# EAGLE design clock_generator (EAGLE 9.6.2)
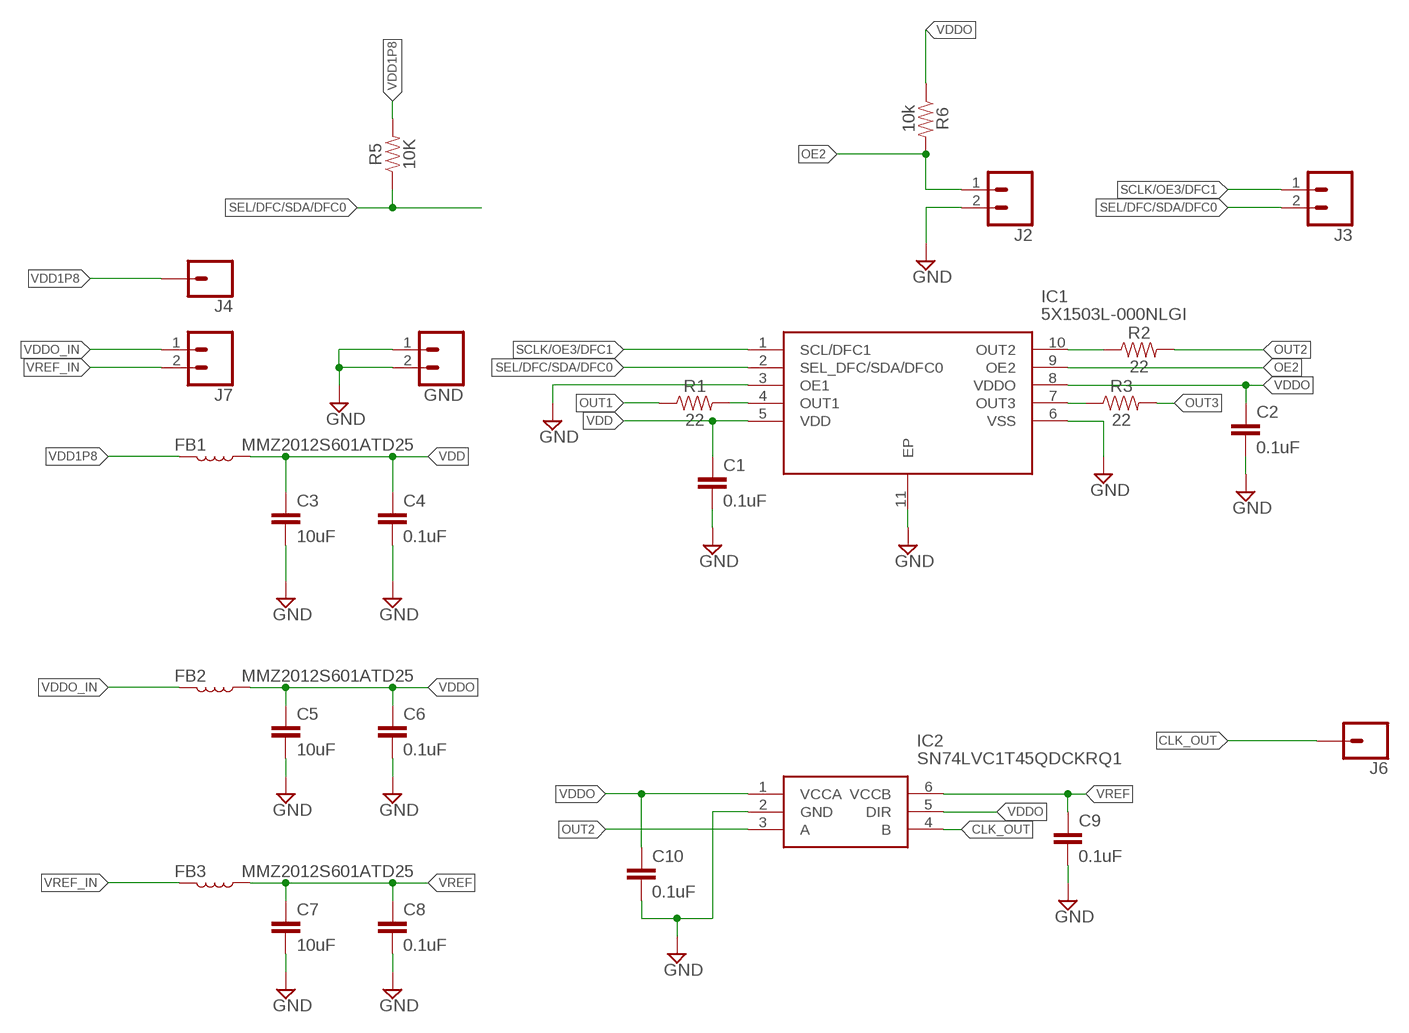
[diagram p0: schematic, sheet 1]

## Parts
C1  0.1uF  1.0UF-0805-25V-10%  [0805]
C2  0.1uF  1.0UF-0805-25V-10%  [0805]
C3  10uF  1.0UF-0805-25V-10%  [0805]
C4  0.1uF  1.0UF-0805-25V-10%  [0805]
C5  10uF  1.0UF-0805-25V-10%  [0805]
C6  0.1uF  1.0UF-0805-25V-10%  [0805]
C7  10uF  1.0UF-0805-25V-10%  [0805]
C8  0.1uF  1.0UF-0805-25V-10%  [0805]
C9  0.1uF  1.0UF-0805-25V-10%  [0805]
C10  0.1uF  1.0UF-0805-25V-10%  [0805]
FB1  MMZ2012S601ATD25  INDUCTOR-0805-3.3UH  [0805]
FB2  MMZ2012S601ATD25  INDUCTOR-0805-3.3UH  [0805]
FB3  MMZ2012S601ATD25  INDUCTOR-0805-3.3UH  [0805]
GND  CONN_02  [1X02]
IC1  5X1503L-000NLGI  [SON40P200X200X110-11N]
IC2  SN74LVC1T45QDCKRQ1  [SOT65P210X110-6N]
J2  CONN_02  [1X02]
J3  CONN_02  [1X02]
J4  CONN_01  [1X01]
J6  CONN_01  [1X01]
J7  CONN_02  [1X02]
R1  22  0.75OHM-0805-1/4W-1%  [0805]
R2  22  0.75OHM-0805-1/4W-1%  [0805]
R3  22  0.75OHM-0805-1/4W-1%  [0805]
R5  10K  0.75OHM-0805-1/4W-1%  [0805]
R6  10k  0.3OHM-0805-1/8W-1%  [0805]

## Nets
CLK_OUT: IC2.4(B) J6.1
GND: C1.2 C2.2 C3.2 C4.2 C5.2 C6.2 C7.2 C8.2 C9.2 C10.2 GND.1 GND.2 IC1.3(OE1) IC1.6(VSS) IC1.11(EP) IC2.2(GND) J2.2
N$1: IC1.7(OUT3) R3.1
N$8: IC1.4(OUT1) R1.2
N$9: IC1.10(OUT2) R2.1
OE2: IC1.9(OE2) J2.1 R6.2
OUT1: R1.1
OUT2: IC2.3(A) R2.2
OUT3: R3.2
SCLK/OE3/DFC1: IC1.1(SCL/DFC1) J3.1
SEL/DFC/SDA/DFC0: IC1.2(SEL_DFC/SDA/DFC0) J3.2 R5.1
VDD: C1.1 C3.1 C4.1 FB1.1 IC1.5(VDD)
VDD1P8: FB1.2 J4.1 R5.2
VDDO: C2.1 C5.1 C6.1 C10.1 FB2.1 IC1.8(VDDO) IC2.1(VCCA) IC2.5(DIR) R6.1
VDDO_IN: FB2.2 J7.1
VREF: C7.1 C8.1 C9.1 FB3.1 IC2.6(VCCB)
VREF_IN: FB3.2 J7.2

## Library data of the parts
C1-C10 = SparkFun-Capacitors:1.0UF: 1µF ceramic capacitors A capacitor is a passive two-terminal electrical component used to store electrical energy temporarily in an electric field.; PROD_ID: CAP-08064; VALUE: 1.0uF
FB1-FB3 = SparkFun-Coils:INDUCTOR: Inductors Resist changes in electrical current. Basically a coil of wire. SparkFun Products: SparkFun Load Cell Amplifier - HX711 <https://www.sparkfun.com/products/13879> IOIO-OTG - V2.2 <https://www.sparkfun.com/products/13613>; PROD_ID: NDUC-13076; VALUE: 3.3µH/±20%/450mA
GND J2 J3 J7 = SparkFun-Connectors:CONN_02: Multi connection point. Often used as Generic Header-pin footprint for 0.1 inch spaced/style header connections On any of the 0.1 inch spaced packages, you can populate with these: Break Away Headers - Straight <https://www.sparkfun.com/products/116> (PRT-00116) Break Away Male Headers - Right Angle <https://www.sparkfun.com/products/553> (PRT-00553) Female Headers <https://www.sparkfun.com/products/115> (PRT-00115) Break Away Headers - Machine Pin <https://www.sparkfun.com/products/117> (PRT-00117) Break Away Female Headers - Swiss Machine Pin <https://www.sparkfun.com/products/743> (PRT-00743) For SCREWTERMINALS and SPRING TERMINALS visit here: Screw Terimnals on SparkFun.com <https://www.sparkfun.com/search/results?term=Screw+Terminals> (5mm/3.5mm/2.54mm spacing) This device is also useful as a general connection point to wire up your design to another part of your project. Our various solder wires solder well into these plated through hole pads. Hook-Up Wire - Assortment (Stranded, 22 AWG) <https://www.sparkfun.com/products/11375> (PRT-11375) Hook-Up Wire - Assortment (Solid Core, 22 AWG) <https://www.sparkfun.com/products/11367> (PRT-11367) View the entire wire category on our website here <https://www.sparkfun.com/categories/141> Special notes: Molex polarized connector foot print use with: PRT-08233 with associated crimp pins and housings. 2.54_SCREWTERM for use with PRT-10571. 3.5mm Screw Terminal footprints for PRT-08084 5mm Screw Terminal footprints for use with PRT-08432
IC1 = SamacSys_Parts:5X1503L-000NLGI: Clock Generators & Support Products Programamble Clock Generator with embedded crystal - Ultra-low power Source: Datasheet <https://componentsearchengine.com/Datasheets/1/5X1503L-000NLGI.pdf>; DESCRIPTION: Clock Generators & Support Products Programamble Clock Generator with embedded crystal - Ultra-low power; HEIGHT: 1.1mm; MANUFACTURER_NAME: Renesas Electronics; MANUFACTURER_PART_NUMBER: 5X1503L-000NLGI; MOUSER_PART_NUMBER: 972-5X1503L-000NLGI; MOUSER_PRICE-STOCK: https://www.mouser.com/Search/Refine.aspx?Keyword=972-5X1503L-000NLGI
IC2 = SamacSys_Parts:SN74LVC1T45QDCKRQ1: Automotive Single-Bit Dual-Supply Bus Transceiver with Configurable Voltage Translation and Source: Datasheet <http://www.ti.com/lit/gpn/sn74lvc1t45-q1>; ARROW_PART_NUMBER: SN74LVC1T45QDCKRQ1; ARROW_PRICE-STOCK: https://www.arrow.com/en/products/sn74lvc1t45qdckrq1/texas-instruments?region=nac; DESCRIPTION: Automotive Single-Bit Dual-Supply Bus Transceiver with Configurable Voltage Translation and; HEIGHT: 1.1mm; MANUFACTURER_NAME: Texas Instruments; MANUFACTURER_PART_NUMBER: SN74LVC1T45QDCKRQ1; MOUSER_PART_NUMBER: 595-74LVC1T45QDCKRQ1; MOUSER_PRICE-STOCK: https://www.mouser.co.uk/ProductDetail/Texas-Instruments/SN74LVC1T45QDCKRQ1?qs=E2%2FxqS9xjzo2gskFKH1Qyw%3D%3D
J4 J6 = SparkFun-Connectors:CONN_01: Single connection point. Often used as Generic Header-pin footprint for 0.1 inch spaced/style header connections On any of the 0.1 inch spaced packages, you can populate with these: Break Away Headers - Straight <https://www.sparkfun.com/products/116> (PRT-00116) Break Away Male Headers - Right Angle <https://www.sparkfun.com/products/553> (PRT-00553) Female Headers <https://www.sparkfun.com/products/115> (PRT-00115) Break Away Headers - Machine Pin <https://www.sparkfun.com/products/117> (PRT-00117) Break Away Female Headers - Swiss Machine Pin <https://www.sparkfun.com/products/743> (PRT-00743) This device is also useful as a general connection point to wire up your design to another part of your project. Our various solder wires solder well into these plated through hole pads. Hook-Up Wire - Assortment (Stranded, 22 AWG) <https://www.sparkfun.com/products/11375> (PRT-11375) Hook-Up Wire - Assortment (Solid Core, 22 AWG) <https://www.sparkfun.com/products/11367> (PRT-11367) View the entire wire category on our website here <https://www.sparkfun.com/categories/141> Special notes: SMTSO-256-ET is a "flush mount" nut for a 4-40 screw. We mostly use this on specialty testbeds; it is a nice way to connect hardware to your PCB at an adjustable hieght. Also note, the SNAP packages are for using a snappable style connector. We sell a baggie of snaps and they are also used on two LilyPad designs: Snap Assortment - 30 pack (male and female) <https://www.sparkfun.com/products/11347> (DEV-11347) LilyPad Arduino SimpleSnap <https://www.sparkfun.com/products/10941> (DEV-10941) LilyPad SimpleSnap Protoboard <https://www.sparkfun.com/products/10940> (DEV-10940)
R1-R3 R5 = SparkFun-Resistors:0.75OHM: 0.75Ω resistor A resistor is a passive two-terminal electrical component that implements electrical resistance as a circuit element. Resistors act to reduce current flow, and, at the same time, act to lower voltage levels within circuits. - Wikipedia; PROD_ID: RES-08474; VALUE: 0.75
R6 = SparkFun-Resistors:0.3OHM: 0.3Ω resistor A resistor is a passive two-terminal electrical component that implements electrical resistance as a circuit element. Resistors act to reduce current flow, and, at the same time, act to lower voltage levels within circuits. - Wikipedia; PROD_ID: RES-11622; VALUE: 0.3

## Board
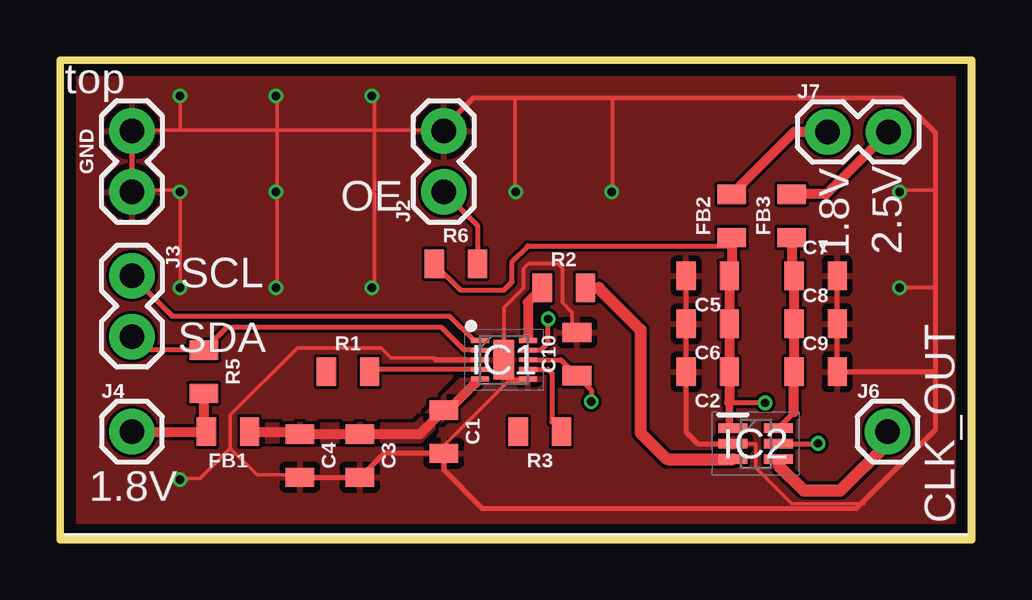
[diagram p1: board, top side]
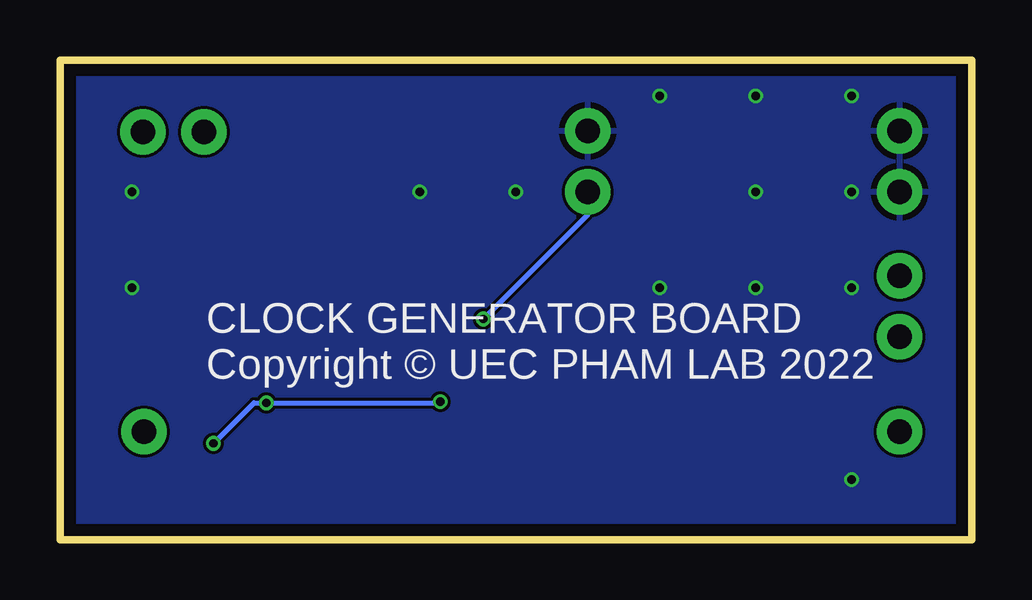
[diagram p2: board, bottom side, seen from below]

Size 38 x 20 mm. Coordinates in mm from the lower left corner, seen from the top.
Outline: 38,0 0,0 0,20 38,20 38,0
Copper layers (1*16): Top 0.035mm / dielectric 1.5mm / Bottom 0.035mm
Design rules "default *": minimum track width 6mil, minimum drill 0.35mm, track to track 5mil, track to pad 0.2mm, pad to pad 6mil, via to via 10mil, smd to smd 10mil, copper to edge 20mil, drill to drill 6mil, minimum pad ring 0.13mm, minimum via ring 0.13mm, stop-mask expansion 4mil, vias tented up to drill 0mil, thermal gap 10mil

### Footprints (pad centres in the part's own frame; a part is rotated, then mirrored left to right if it is on the bottom)
0805 = smd 0.8 x 1.2: 1 -0.9,0; 2 0.9,0
1X02 = drill 1.016 pad 1.88: 1 0,0; 2 2.54,0
SON40P200X200X110-11N = smd 0.75 x 0.2: 1 -1,0.8; 2 -1,0.4; 3 -1,0; 4 -1,-0.4; 5 -1,-0.8; 6 1,-0.8; 7 1,-0.4; 8 1,0; 9 1,0.4; 10 1,0.8 | smd 0.85 x 1.65: 11 0,0
SOT65P210X110-6N = smd 1.2 x 0.4: 1 -0.95,0.65; 2 -0.95,0; 3 -0.95,-0.65; 4 0.95,-0.65; 5 0.95,0; 6 0.95,0.65
1X01 = drill 1.016 pad 1.88: 1 0,0

### Placement (x,y rotation side)
C1  16,4.5 270 top
C2  27,7 180 top
C3  12.5,3.5 270 top
C4  10,3.5 270 top
C5  27,11 180 top
C6  27,9 180 top
C7  31.5,11 0 top
C8  31.5,9 0 top
C9  31.5,7 0 top
C10  21.55,7.73 90 top
FB1  7,4.5 180 top
FB2  28,13.5 90 top
FB3  30.5,13.5 90 top
GND  3,14.5 90 top
IC1  18.5,7.5 0 top
IC2  29,4 0 top
J2  16,14.5 90 top
J3  3,11 270 top
J4  3,4.5 0 top
J6  34.5,4.5 0 top
J7  32,17 0 top
R1  12,7 0 top
R2  21,10.5 0 top
R3  20,4.5 180 top
R5  6,7 270 top
R6  16.5,11.5 0 top

### Tracks (layer width: path | path; a pad name or v marks a point on that pad's centre or on a via)
CLK_OUT
  Top 0.305: IC2.4 29.95,3.1
  Top 0.508: 29.95,3.1 31,2.05 32.55,2.05 34.5,4 J6.1
GND  (via drill 0.35)
  Top 0.152: IC1.6 19.52,6.63 19.52,6.65 | C9.2 32.53,7.03 32.45,7.05 | C10.2 21.35,8.66 21.35,9.47 20.95,9.88 20.95,11.3 20.74,11.51 19.52,11.51 19.32,11.3 19.32,10.49 18.51,9.68 18.51,7.64 IC1.11 | 18.8,6.65 18.71,6.63 15.87,3.78 C1.2 | IC2.2 29,4 29,3 30.5,1.5 33.5,1.5 33.45,1.55 | 7.1,3.81 7.1,5.21 9.9,8 13.39,8 13.81,7.58 15.62,7.58 15.65,7.5 | 7.1,3.81 8.22,2.69 9.9,2.69 C4.2 | 13.11,17.08 15.76,17.08 J2.2 | 13.11,17.08 9.06,17.08 | 9.06,17.08 5.01,17.08 | 5.01,17.08 3.05,17.08 GND.2 | v13,10.5 13.11,10.51 13.11,14.43 13,14.5 13.11,14.57 13.11,17.08 | v9,10.5 9.06,10.51 9.06,14.43 v9,14.5 9.06,14.57 9.06,17.08 | v5,10.5 5.01,10.51 5.01,14.43 v5,14.5 4.87,14.57 3.05,14.57 GND.1 | 7.1,3.81 5.84,2.55 5.01,2.55 v5,2.5 | 5.01,17.08 5.01,18.48 v5,18.5 | 9.06,17.08 9.06,18.48 v9,18.5 | 13.11,17.08 13.11,18.48 v13,18.5 | 18.98,18.4 18.98,14.57 v19,14.5 | 23.03,18.4 23.03,14.57 v23,14.5 | 36.5,10.51 35.04,10.51 v35,10.5 | 36.5,14.57 35.04,14.57 v35,14.5
  Top 0.2: IC1.11 18.5,6.95 18.8,6.65 19.52,6.65 19.55,6.65 | C7.2 C8.2 C9.2 36.5,7 | C5.2 C6.2 C2.2 26.1,4.5 26.6,4 IC2.2 | J2.2 15.85,17.04 17.21,18.4 18.98,18.4 23.03,18.4 35.05,18.4 36.5,16.95 36.5,14.57 36.5,10.51 36.5,7 | C4.2 C3.2 13.5,3.6 C1.2 16,2.9 17.6,1.3 33.2,1.3 33.45,1.55 36.5,4.6 36.5,7 | GND.1 GND.2 | IC1.3 15.65,7.5
  Bottom 0.152: 16.04,16.94 J2.2
  pour Top (rank 2): 0,20 38,20 38,0 0,0
  pour Bottom (rank 2): 0,20 38,20 38,0 0,0
N$1
  Top 0.2: IC1.7 20.35,7.1 20.5,6.95 20.5,4.9 R3.1
N$8
  Top 0.2: R1.2 13,7.1 IC1.4
N$9
  Top 0.2: IC1.10 19.5,8.45
  Top 0.406: 19.5,8.45 19.5,9.9 R2.1
OE2  (via drill 0.35)
  Top 0.2: IC1.9 20.05,7.9 20.35,8.2 v20.35,9.2 | J2.1 17.4,13.1 R6.2
  Bottom 0.2: v20.35,9.2 16,13.55 J2.1
OUT2
  Top 0.152: IC2.3 28.06,3.39 IC2.3
  Top 0.2: 22.1,10.5 R2.2
  Top 0.508: R2.2 22.45,10.5 24.2,8.75 24.2,4.45 25.3,3.35 IC2.3
SCLK/OE3/DFC1
  Top 0.2: J3.1 4.7,9.3 16.25,9.3 17.25,8.3 IC1.1
SEL/DFC/SDA/DFC0
  Top 0.2: J3.2 3.56,7.9 R5.1 6.95,8.85 15.9,8.85 16.85,7.9 IC1.2
VDD
  Top 0.2: IC1.5 17.35,6.55
  Top 0.406: 17.35,6.55 16.2,5.4 C1.1 15,4.4 C3.1 C4.1 9.9,4.5 FB1.1
  pour Top (isolate 0.254): 7.95,4.8 14.85,4.8 16.75,6.7 17.3,6.7 17.3,6.4 15,4.1 8.2,4.1 7.95,4.35
VDD1P8
  Top 0.406: J4.1 5.9,4.5 6,4.6 | FB1.2 6,4.6 | 6,4.6 R5.2
VDDO  (via drill 0.35)
  Top 0.2: IC1.8 20.88,7.5 C10.1 22.15,6.23 v22.15,5.75 | FB2.1 28,12.45 27.8,12.25 19.5,12.25 18.85,11.6 18.85,10.75 18.5,10.4 16.7,10.4 R6.1 | IC2.5 v31.59,4 v31.6,4.01 | v29.4,5.7 27.9,5.7 | IC2.1 27.9,4.8
  Top 0.305: 27.9,5.7 27.9,4.8
  Top 0.406: FB2.1 28,11.1 C5.1 C6.1 C2.1 27.9,5.7
  Bottom 0.2: v31.6,4.01 29.91,5.7 v29.4,5.7 22.2,5.7 v22.15,5.75
VDDO_IN
  Top 0.406: J7.1 30.6,17 FB2.2
VREF
  Top 0.2: IC2.6 30.6,5.31
  Top 0.406: FB3.1 30.5,11.1 C7.1 C8.1 C9.1 30.6,5.31
VREF_IN
  Top 0.406: J7.2 31.94,14.4 FB3.2

### Text on the board
tPlace: top | OE | 1.8V | 2.5V | SCL | SDA | 1.8V | CLK_OUT
bNames: CLOCK GENERATOR BOARD / Copyright © UEC PHAM LAB 2022